# EAGLE design IR_beaconSD (EAGLE 9.4.2)
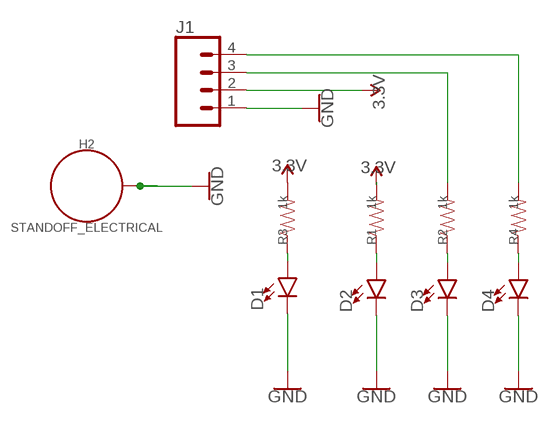
[diagram p0: schematic, sheet 1]

## Parts
D1  LED-FKIT-1206  [FKIT-LED-1206]
D2  LED-FKIT-1206  [FKIT-LED-1206]
D3  LED-FKIT-1206  [FKIT-LED-1206]
D4  LED-FKIT-1206  [FKIT-LED-1206]
H2  STANDOFF_ELECTRICAL  [STANDOFF-ELECTRICAL]
J1  CONN_04LONGPADS  [1X04_LONGPADS]
R1  1k  1KOHM-HORIZ-1/4W-5%  [AXIAL-0.3]
R2  1k  1KOHM-HORIZ-1/4W-5%  [AXIAL-0.3]
R3  1k  1KOHM-HORIZ-1/4W-5%  [AXIAL-0.3]
R4  1k  1KOHM-HORIZ-1/4W-5%  [AXIAL-0.3]

## Nets
3.3V [5v]: J1.2 R1.P$2 R3.P$2
GND: D1.C D2.C D3.C D4.C H2.P1 J1.1
N$1: J1.4 R4.P$2
N$2: D1.A R3.P$1
N$3: D3.A R2.P$1
N$4: D2.A R1.P$1
N$5: D4.A R4.P$1
N$6: J1.3 R2.P$2

## Library data of the parts
D1-D4 = SparkFun-LED:LED: LED (Generic) Standard schematic elements and footprints for 5mm, 3mm, 1206, and 0603 sized LEDs. Generic LEDs with no color specified.
H2 = IAD-Library:STANDOFF_ELECTRICAL: Stand Off Drill holes with an electrical connection to ground your board to a chassis.
J1 = SparkFun-Connectors:CONN_04: Multi connection point. Often used as Generic Header-pin footprint for 0.1 inch spaced/style header connections On any of the 0.1 inch spaced packages, you can populate with these: Break Away Headers - Straight <https://www.sparkfun.com/products/116> (PRT-00116) Break Away Male Headers - Right Angle <https://www.sparkfun.com/products/553> (PRT-00553) Female Headers <https://www.sparkfun.com/products/115> (PRT-00115) Break Away Headers - Machine Pin <https://www.sparkfun.com/products/117> (PRT-00117) Break Away Female Headers - Swiss Machine Pin <https://www.sparkfun.com/products/743> (PRT-00743) For SCREWTERMINALS and SPRING TERMINALS visit here: Screw Terimnals on SparkFun.com <https://www.sparkfun.com/search/results?term=Screw+Terminals> (5mm/3.5mm/2.54mm spacing) This device is also useful as a general connection point to wire up your design to another part of your project. Our various solder wires solder well into these plated through hole pads. Hook-Up Wire - Assortment (Stranded, 22 AWG) <https://www.sparkfun.com/products/11375> (PRT-11375) Hook-Up Wire - Assortment (Solid Core, 22 AWG) <https://www.sparkfun.com/products/11367> (PRT-11367) View the entire wire category on our website here <https://www.sparkfun.com/categories/141> Special notes: Molex polarized connector foot print use with SKU : PRT-08231 with associated crimp pins and housings. 1MM SMD Version SKU: PRT-10208; PROD_ID: CONN-09696
R1-R4 = SparkFun-Resistors:1KOHM: 1kΩ resistor A resistor is a passive two-terminal electrical component that implements electrical resistance as a circuit element. Resistors act to reduce current flow, and, at the same time, act to lower voltage levels within circuits. - Wikipedia; PROD_ID: RES-08380

## Net classes
0 default: width 0.4 mm, clearance 0.2 mm
1 5v: width 0.6 mm, clearance 0.2 mm

## Board
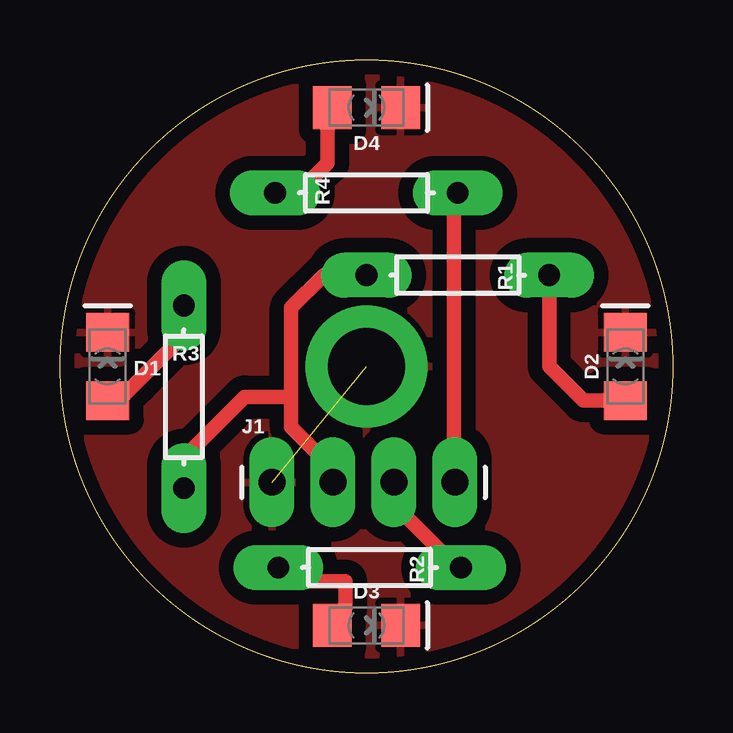
[diagram p1: board, top side]

Size 25.56 x 25.56 mm. Coordinates in mm from the lower left corner, seen from the top.
Outline: circle at 12.78,12.78 radius 12.78
Copper layers (1*16): Top 0.035mm / dielectric 1.5mm / Bottom 0.035mm
Design rules "SparkFun *": minimum track width 8mil, minimum drill 20mil, track to track 10mil, track to pad 8mil, pad to pad 8mil, via to via 8mil, smd to smd 8mil, copper to edge 4mil, drill to drill 8mil, minimum pad ring 12mil, minimum via ring 10mil, stop-mask expansion 4mil, vias tented up to drill 25mil, thermal gap 10mil

### Footprints (pad centres in the part's own frame; a part is rotated, then mirrored left to right if it is on the bottom)
FKIT-LED-1206 = smd 1.6 x 1.803: A -1.422,0; C 1.422,0
STANDOFF-ELECTRICAL = drill 3.2 pad 5.08: P1 0,0
1X04_LONGPADS = drill 1.118 pad 1.88 long: 1 0,0; 2 2.54,0; 3 5.08,0; 4 7.62,0
AXIAL-0.3 = drill 0.9 pad 1.88 long: P$1 -3.81,0; P$2 3.81,0

### Placement (x,y rotation side)
D1  1.99,12.78 90 top
D2  23.58,12.78 90 top
D3  12.78,1.99 0 top
D4  12.78,23.58 0 top
H2  12.78,12.78 0 top
J1  8.84,7.95 0 top
R1  16.59,16.59 180 top
R2  12.91,4.4 0 top
R3  5.16,11.51 270 top
R4  12.78,20.02 0 top

### Tracks (layer width: path | path; a pad name or v marks a point on that pad's centre or on a via)
3.3V
  Top 0.6: 11.3,7.99 J1.2 | 11.3,7.39 11.3,7.69 J1.2 | 5.27,7.6 R3.P$2 5.16,8.97 7.7,11.51 9.64,11.51 | 9.64,11.51 9.64,10.25 11.3,8.6 11.3,8.29 J1.2 | 9.64,11.51 9.64,15.23 11,16.59 R1.P$2
GND  (1 unrouted)
  pour Top (isolate 0.6): -25.34,30.32 34.34,30.32 34.34,-17.71 -25.34,-17.71
N$1
  Top 0.4: 16.43,7.99 J1.4 16.43,8.14 | R4.P$2 16.43,19.86
  Top 0.61: 16.43,19.86 16.43,8.14
N$2
  Top 0.4: 2.25,11.16 2.1,11.31 D1.A 2.25,11.46 2.55,11.46
  Top 0.6: 3.2,12.11 5.16,14.07 R3.P$1
  Top 0.61: 2.55,11.46 3.2,12.11
N$3
  Top 0.4: 11.45,2.11 D3.A 11.45,2.26 11.9,2.71 | 8.97,3.82 9.04,3.82 9.04,4.42 R2.P$1
  Top 0.61: 11.9,2.71 11.9,3.82 9.04,3.82
N$4
  Top 0.4: 23.52,11.46 D2.A 23.37,11.46 23.06,11.46
  Top 0.6: D2.A 21.82,11.36 20.4,12.78 R1.P$1
N$5
  Top 0.4: 11.15,23.37 11.3,23.53 D4.A 11.15,23.22
  Top 0.61: 11.15,23.22 11.15,21.26 10.34,20.45 R4.P$1
N$6
  Top 0.4: 13.56,7.54 13.86,7.84 J1.3 | R2.P$2 16.7,4.42 16.58,4.37
  Top 0.61: 16.58,4.37 13.56,7.39 J1.3